# EAGLE design cicely_A_v1 (EAGLE 9.6.2)
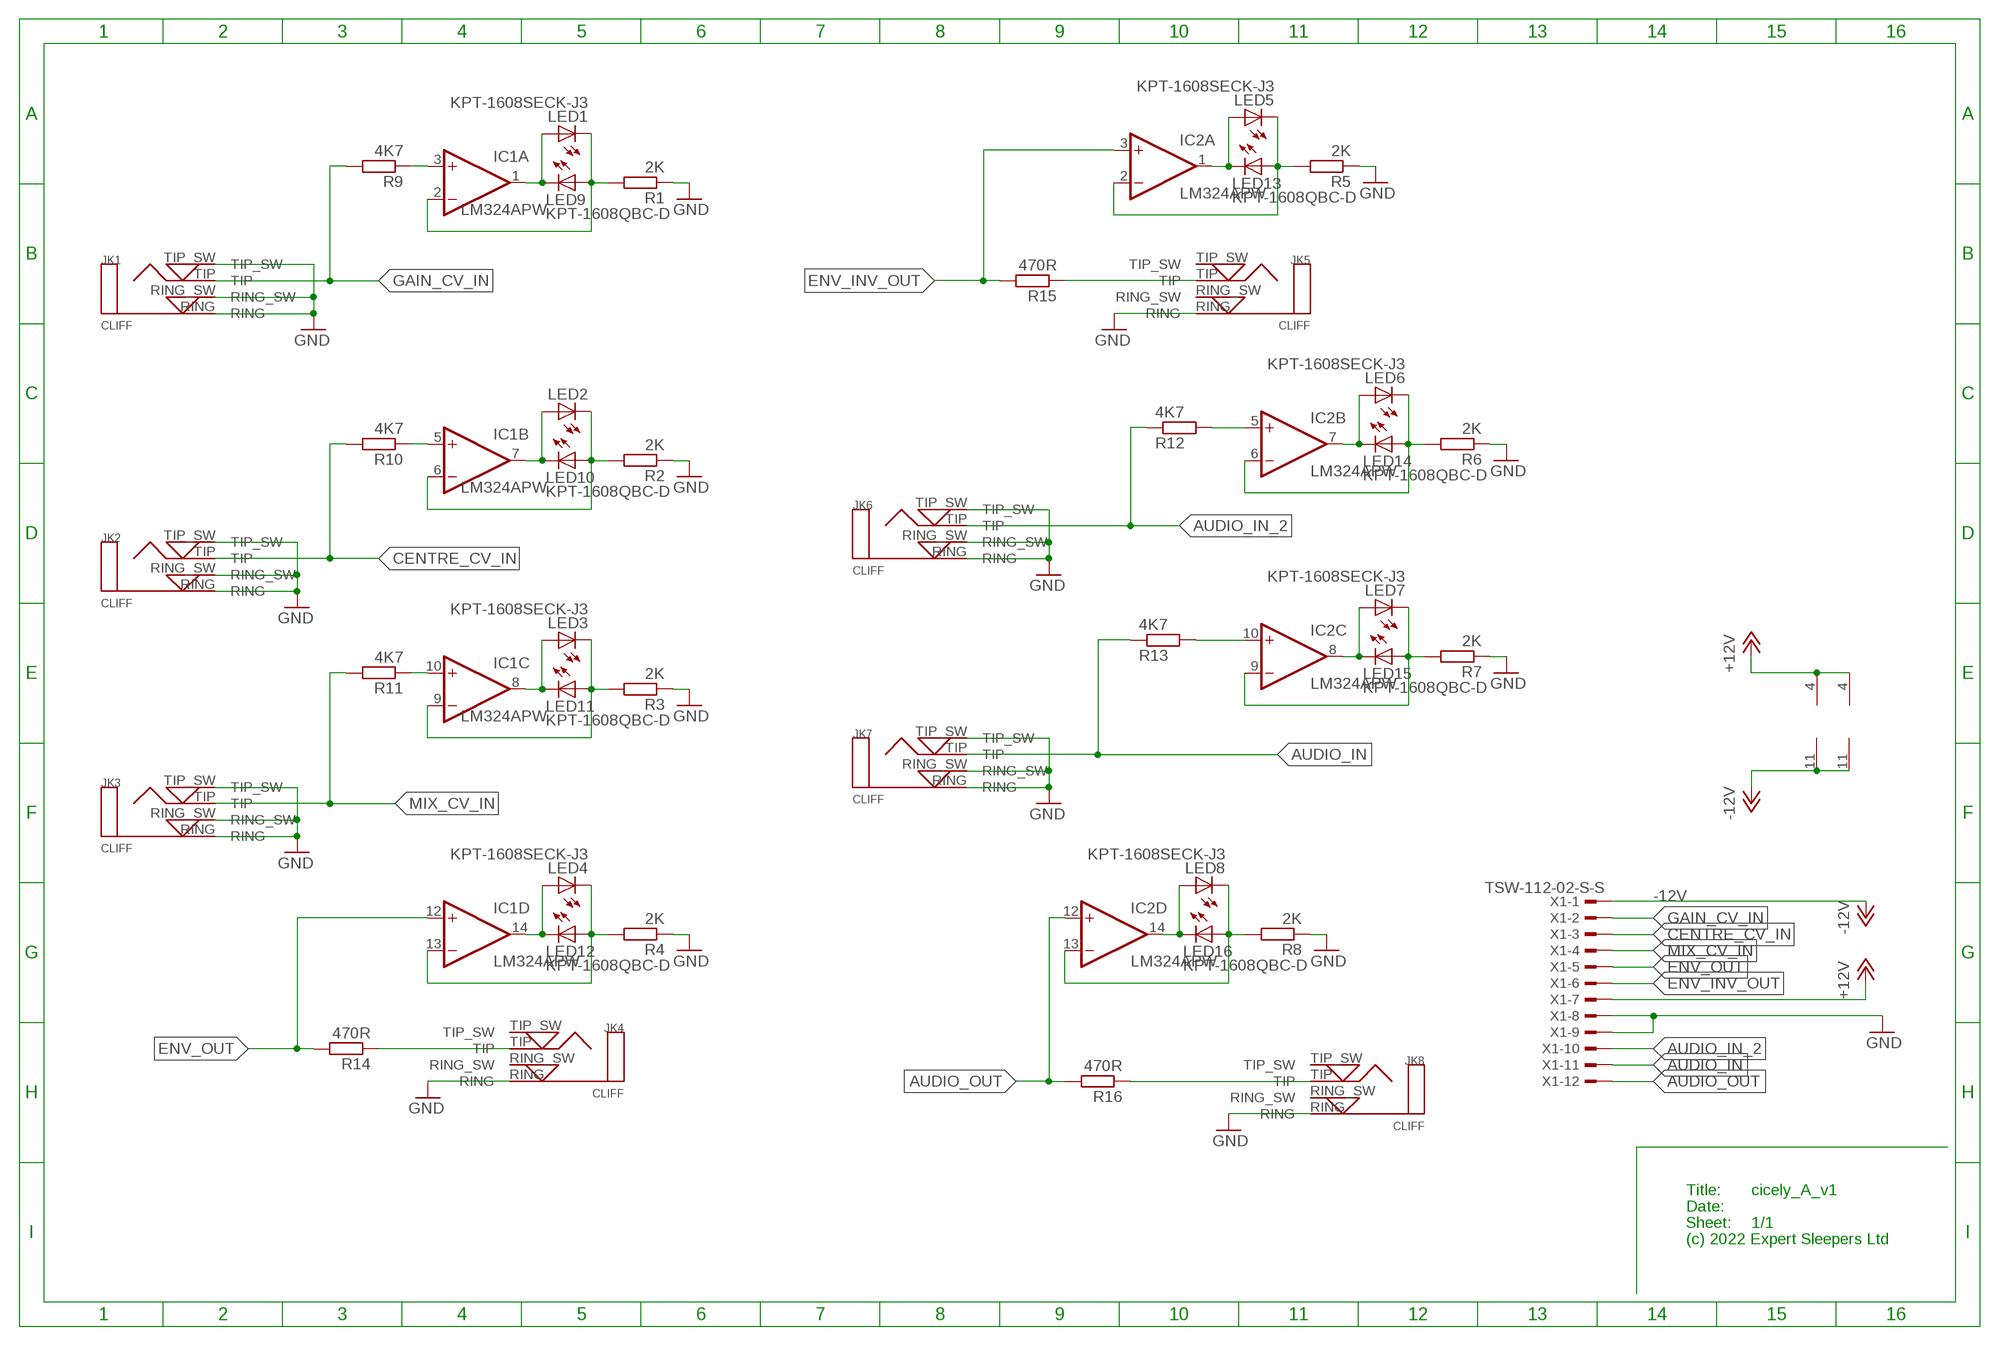
[diagram p0: schematic, sheet 1]

## Parts
IC1  LM324APW  TL074PW  [PW_R-PDSO-G14]
IC2  LM324APW  TL074PW  [PW_R-PDSO-G14]
JK1  CLIFF  CLIFF3.5MM_PCB_SW_JK  [CLIFF3.5MMPCB]
JK2  CLIFF  CLIFF3.5MM_PCB_SW_JK  [CLIFF3.5MMPCB]
JK3  CLIFF  CLIFF3.5MM_PCB_SW_JK  [CLIFF3.5MMPCB]
JK4  CLIFF  CLIFF3.5MM_PCB_SW_JK  [CLIFF3.5MMPCB]
JK5  CLIFF  CLIFF3.5MM_PCB_SW_JK  [CLIFF3.5MMPCB]
JK6  CLIFF  CLIFF3.5MM_PCB_SW_JK  [CLIFF3.5MMPCB]
JK7  CLIFF  CLIFF3.5MM_PCB_SW_JK  [CLIFF3.5MMPCB]
JK8  CLIFF  CLIFF3.5MM_PCB_SW_JK  [CLIFF3.5MMPCB]
LED1  KPT-1608SECK-J3  [CHIPLED_0603_LEFT]
LED2  KPT-1608SECK-J3  [CHIPLED_0603_LEFT]
LED3  KPT-1608SECK-J3  [CHIPLED_0603_LEFT]
LED4  KPT-1608SECK-J3  [CHIPLED_0603_LEFT]
LED5  KPT-1608SECK-J3  [CHIPLED_0603_LEFT]
LED6  KPT-1608SECK-J3  [CHIPLED_0603_LEFT]
LED7  KPT-1608SECK-J3  [CHIPLED_0603_LEFT]
LED8  KPT-1608SECK-J3  [CHIPLED_0603_LEFT]
LED9  KPT-1608QBC-D  [CHIPLED_0603_RIGHT]
LED10  KPT-1608QBC-D  [CHIPLED_0603_RIGHT]
LED11  KPT-1608QBC-D  [CHIPLED_0603_RIGHT]
LED12  KPT-1608QBC-D  [CHIPLED_0603_RIGHT]
LED13  KPT-1608QBC-D  [CHIPLED_0603_RIGHT]
LED14  KPT-1608QBC-D  [CHIPLED_0603_RIGHT]
LED15  KPT-1608QBC-D  [CHIPLED_0603_RIGHT]
LED16  KPT-1608QBC-D  [CHIPLED_0603_RIGHT]
R1  2K  R-EU_R1206  [R1206]
R2  2K  R-EU_R1206  [R1206]
R3  2K  R-EU_R1206  [R1206]
R4  2K  R-EU_R1206  [R1206]
R5  2K  R-EU_R1206  [R1206]
R6  2K  R-EU_R1206  [R1206]
R7  2K  R-EU_R1206  [R1206]
R8  2K  R-EU_R1206  [R1206]
R9  4K7  R-EU_R1206  [R1206]
R10  4K7  R-EU_R1206  [R1206]
R11  4K7  R-EU_R1206  [R1206]
R12  4K7  R-EU_R1206  [R1206]
R13  4K7  R-EU_R1206  [R1206]
R14  470R  R-EU_R1206  [R1206]
R15  470R  R-EU_R1206  [R1206]
R16  470R  R-EU_R1206  [R1206]
X1  TSW-112-02-S-S  [TSW-112-02-S-S]

## Nets
+12V: IC1.4(P:V+) IC2.4(P:V+) X1.7
-12V: IC1.11(P:V-) IC2.11(P:V-) X1.1
AUDIO_IN: JK7.TIP R13.1 X1.11
AUDIO_IN_2: JK6.TIP R12.1 X1.10
AUDIO_OUT: IC2.12(D:+IN) R16.2 X1.12
CENTRE_CV_IN: JK2.TIP R10.2 X1.3
ENV_INV_OUT: IC2.3(A:+IN) R15.2 X1.6
ENV_OUT: IC1.12(D:+IN) R14.2 X1.5
ENV_OUT_JACK: JK4.TIP R14.1
ENV_OUT_JACK1: JK5.TIP R15.1
GAIN_CV_IN: JK1.TIP R9.2 X1.2
GND [power]: JK1.RING JK1.RING_SW JK1.TIP_SW JK2.RING JK2.RING_SW JK2.TIP_SW JK3.RING JK3.RING_SW JK3.TIP_SW JK4.RING JK5.RING JK6.RING JK6.RING_SW JK6.TIP_SW JK7.RING JK7.RING_SW JK7.TIP_SW JK8.RING R1.1 R2.1 R3.1 R4.1 R5.1 R6.1 R7.1 R8.1 X1.8 X1.9
MIX_CV_IN: JK3.TIP R11.2 X1.4
N$3: IC1.10(C:+IN) R11.1
N$4: IC1.13(D:-IN) LED4.1(C) LED12.1(A) R4.2
N$5: IC1.14(D:OUT) LED4.2(A) LED12.2(C)
N$6: IC2.2(A:-IN) LED5.1(C) LED13.1(A) R5.2
N$11: IC1.8(C:OUT) LED3.2(A) LED11.2(C)
N$16: IC1.5(B:+IN) R10.1
N$17: IC1.9(C:-IN) LED3.1(C) LED11.1(A) R3.2
N$19: IC1.1(A:OUT) LED1.2(A) LED9.2(C)
N$21: IC2.10(C:+IN) R13.2
N$22: IC1.2(A:-IN) LED1.1(C) LED9.1(A) R1.2
N$25: IC1.3(A:+IN) R9.1
N$29: IC1.7(B:OUT) LED2.2(A) LED10.2(C)
N$30: IC1.6(B:-IN) LED2.1(C) LED10.1(A) R2.2
N$47: IC2.5(B:+IN) R12.2
N$62: IC2.8(C:OUT) LED7.2(A) LED15.2(C)
N$63: IC2.9(C:-IN) LED7.1(C) LED15.1(A) R7.2
N$65: IC2.14(D:OUT) LED8.2(A) LED16.2(C)
N$66: IC2.13(D:-IN) LED8.1(C) LED16.1(A) R8.2
N$71: IC2.7(B:OUT) LED6.2(A) LED14.2(C)
N$72: IC2.6(B:-IN) LED6.1(C) LED14.1(A) R6.2
N$76: JK8.TIP R16.1
N$89: IC2.1(A:OUT) LED5.2(A) LED13.2(C)
Unconnected: JK4.RING_SW JK4.TIP_SW JK5.RING_SW JK5.TIP_SW JK8.RING_SW JK8.TIP_SW

## Notes on the sheet
- Title:
- Date:
- Sheet:
- (c) 2022 Expert Sleepers Ltd

## Library data of the parts
IC1 IC2 = digital-audio:TL074: OP AMP
JK1-JK8 = cliff:CLIFF3.5MM_PCB_SW_JK: Cliff 3.5mm Mono PCB switched jack socket
LED1-LED8 = kingbright:KPT-1608SECK-J3
LED9-LED16 = kingbright:KPT-1608QBC-D
R1-R16 = rcl:R-EU_: RESISTOR, European symbol
X1 = con-samtec:TSW-112-02-S-S: THROUGH-HOLE .025" SQ POST HEADER Source: Samtec TSW.pdf; OC_FARNELL: unknown; OC_NEWARK: unknown

## Board
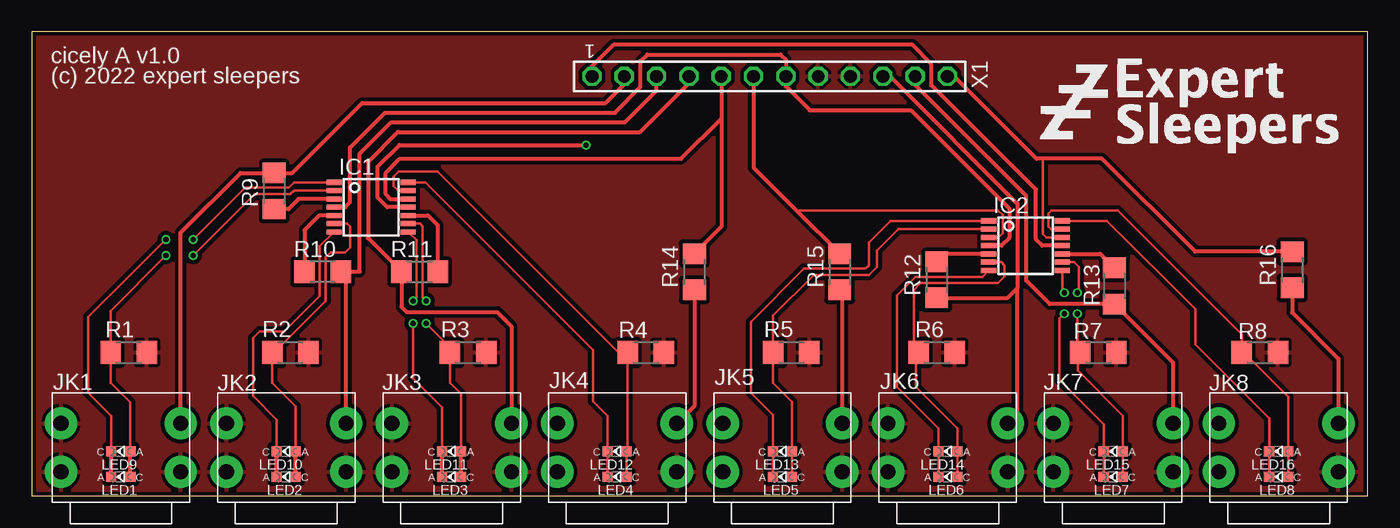
[diagram p1: board, top side]
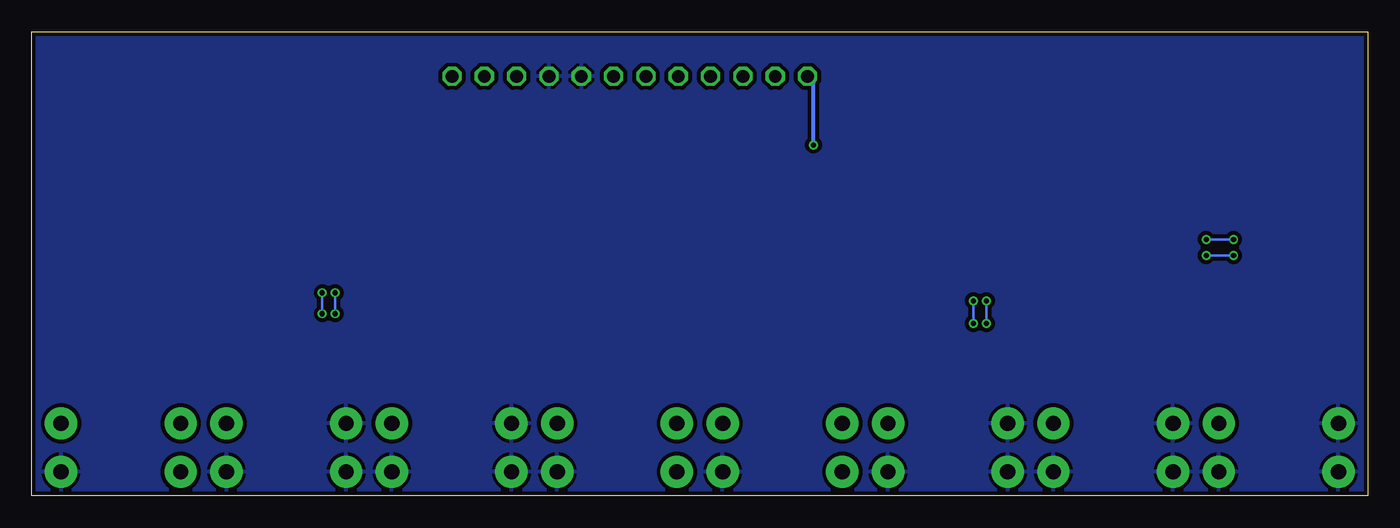
[diagram p2: board, bottom side, seen from below]

Size 105 x 36.5 mm. Coordinates in mm from the lower left corner, seen from the top.
Outline: 0,0 105,0 105,36.5 0,36.5 0,0
Copper layers (1*16): Top 0.035mm / dielectric 1.5mm / Bottom 0.035mm
Design rules "pcbtrain *": minimum track width 0.125mm, minimum drill 0.3mm, track to track 0.125mm, track to pad 0.125mm, pad to pad 0.125mm, via to via 0.125mm, smd to smd 0.125mm, copper to edge 0.25mm, drill to drill 8mil, minimum pad ring 0.15mm, minimum via ring 0.15mm, stop-mask expansion 4mil, vias tented up to drill 0mil, thermal gap 10mil

### Footprints (pad centres in the part's own frame; a part is rotated, then mirrored left to right if it is on the bottom)
PW_R-PDSO-G14 = smd 0.4 x 1.2: 1 -1.95,-2.9; 2 -1.3,-2.9; 3 -0.65,-2.9; 4 0,-2.9; 5 0.65,-2.9; 6 1.3,-2.9; 7 1.95,-2.9; 8 1.95,2.9; 9 1.3,2.9; 10 0.65,2.9; 11 0,2.9; 12 -0.65,2.9; 13 -1.3,2.9; 14 -1.95,2.9
CLIFF3.5MMPCB = drill 1.2 pad 2.54: RING 4.7,-1.9; RING_SW -4.7,-1.9; TIP 4.7,1.9; TIP_SW -4.7,1.9
CHIPLED_0603_LEFT = smd 0.8 x 0.8: 1 0,-0.75; 2 0,0.75
CHIPLED_0603_RIGHT = smd 0.8 x 0.8: 1 0,-0.75; 2 0,0.75
R1206 = smd 1.6 x 1.803: 1 -1.422,0; 2 1.422,0
TSW-112-02-S-S = drill 1 pad 1.5 octagon: 1 13.97,0; 2 11.43,0; 3 8.89,0; 4 6.35,0; 5 3.81,0; 6 1.27,0; 7 -1.27,0; 8 -3.81,0; 9 -6.35,0; 10 -8.89,0; 11 -11.43,0; 12 -13.97,0

### Placement (x,y rotation side)
IC1  26.67,22.71 270 top
IC2  78.11,19.68 270 top
JK1  7,3.8 0 top
JK2  20,3.8 0 top
JK3  33,3.8 0 top
JK4  46,3.8 0 top
JK5  59,3.8 0 top
JK6  72,3.8 0 top
JK7  85,3.8 0 top
JK8  98,3.8 0 top
LED1  7,1.5 90 top
LED2  20,1.5 90 top
LED3  33,1.5 90 top
LED4  46,1.5 90 top
LED5  59,1.5 90 top
LED6  72,1.5 90 top
LED7  85,1.5 90 top
LED8  98,1.5 90 top
LED9  7,3.5 90 top
LED10  20,3.5 90 top
LED11  33,3.5 90 top
LED12  46,3.5 90 top
LED13  59,3.5 90 top
LED14  72,3.5 90 top
LED15  85,3.5 90 top
LED16  98,3.5 90 top
R1  7.62,11.28 180 top
R2  20.32,11.28 180 top
R3  34.29,11.28 180 top
R4  48.26,11.28 180 top
R5  59.69,11.28 180 top
R6  71.12,11.28 180 top
R7  83.82,11.28 180 top
R8  96.52,11.28 180 top
R9  19.05,23.98 90 top
R10  22.86,17.63 0 top
R11  30.48,17.63 180 top
R12  71.12,17 90 top
R13  85.09,16.51 90 top
R14  52.07,17.63 90 top
R15  63.5,17.63 90 top
R16  99.06,17.78 90 top
U$1  [ES_ZZZ_TEXT_TPLACE_1IN_600DPI]  78.28,26.53 0 top
X1  58,33 180 top

### Tracks (layer width: path | path; a pad name or v marks a point on that pad's centre or on a via)
+12V
  Top 0.305: IC1.4 24.64,22.71 25.02,23.09 25.02,27.41 27.75,30.14 45.85,30.14 47.84,32.17 47.84,34.2 48.39,34.71 58.86,34.71 59.27,34.31 X1.7 59.27,32.21 61.15,30.33 69.09,30.33 76.83,22.58 76.83,20.3 76.22,19.68 IC2.4
-12V  (via drill 0.4)
  Top 0.305: IC2.11 79.42,19.68 78.93,20.17 78.93,24.11 70.7,32.3 70.7,33.95 69.21,35.47 45.72,35.47 44.03,33.78 X1.1 | IC1.11 27.94,22.71 27.18,23.47 27.18,25.89 28.89,27.6 v43.56,27.6
  Bottom 0.305: v43.56,27.6 43.56,32.53 X1.1
AUDIO_IN
  Top 0.305: X1.11 69.43,32.34 78.17,23.6 78.17,16.93 80.01,15.09 R13.1 87.63,12.55 89.7,10.48 JK7.TIP
AUDIO_IN_2
  Top 0.305: X1.10 67.43,33 77.47,22.96 77.47,16.36 | JK6.TIP 77.47,6.47 77.47,16.36 | R12.1 76.68,15.57 77.47,16.36
AUDIO_OUT
  Top 0.203: IC2.12 79.73,20.34 79.48,20.59 79.48,26.52
  Top 0.305: R16.2 91.44,19.2 84.12,26.52 79.48,26.52 78.97,26.52 72.49,33 X1.12
CENTRE_CV_IN
  Top 0.305: X1.3 49.11,31.88 46.61,29.38 28.26,29.38 25.78,26.9 25.78,17.63 R10.2 24.7,17.21 JK2.TIP
ENV_INV_OUT
  Top 0.203: IC2.3 75.98,20.34 76.33,20.68 76.33,22.07 75.95,22.46 60.1,22.46
  Top 0.305: X1.6 56.73,25.82 60.1,22.46 R15.2
ENV_OUT
  Top 0.305: 54.19,29.68 51.03,26.52 28.93,26.52 27.82,25.41 27.82,23.72 28.18,23.36 IC1.12 | X1.5 54.19,29.68 | R14.2 54.19,21.17 54.19,29.68
ENV_OUT_JACK
  Top 0.305: R14.1 52.07,7.07 JK4.TIP
ENV_OUT_JACK1
  Top 0.305: JK5.TIP 63.7,16.01 R15.1
GAIN_CV_IN
  Top 0.305: JK1.TIP 11.7,20.69 16.41,25.4 R9.2 20.47,25.4 25.97,30.9 45.08,30.9 46.57,32.39 X1.2
GND
  pour Top (isolate 0.305): 0,0 105,0 105,36.5 0,36.5
  pour Bottom (isolate 0.305): 0,0 105,0 105,36.5 0,36.5
MIX_CV_IN
  Top 0.305: X1.4 51.65,32.45 47.82,28.62 28.77,28.62 26.42,26.27 26.42,20.27 R11.2 29.06,14.86 29.46,14.46 36.58,14.46 37.7,13.33 JK3.TIP
N$3
  Top 0.305: IC1.10 31.13,22.06 31.9,21.29 R11.1
N$4
  Top 0.203: LED4.1 LED12.1 46.84,3.59 R4.2 46.1,11.28 31.88,25.5 28.83,25.5 28.45,25.12 28.45,24.36 28.8,24.01 IC1.13
N$5
  Top 0.203: LED4.2 LED12.2 45.25,6.29 44.11,7.44 44.11,11.5 30.94,24.66 IC1.14
N$6
  Top 0.203: LED5.1 LED13.1 59.75,7.41 58.27,8.89 R5.2 58.27,14.18 61.47,17.38 65.79,17.38 66.42,18.01 66.42,19.28 68.12,20.98 IC2.2
N$11  (via drill 0.4)
  Top 0.203: IC1.8 30.23,20.1 30.23,15.6 v29.97,15.34 | v29.97,13.57 29.97,9.25 32.25,6.97 LED11.2
  Top 0.305: LED3.2 LED11.2
  Bottom 0.203: v29.97,15.34 v29.97,13.57
N$16
  Top 0.305: IC1.5 22.59,22.06 21.44,20.91 R10.1
N$17  (via drill 0.4)
  Top 0.203: IC1.9 30.51,21.41 30.73,21.19 30.73,15.6 v30.99,15.34 | v30.99,13.57 32.87,11.69 R3.2 32.87,8.89 33.75,8.01 LED11.1
  Top 0.305: LED3.1 LED11.1
  Bottom 0.203: v30.99,15.34 v30.99,13.57
N$19  (via drill 0.4)
  Top 0.203: IC1.1 20.62,24.66 20.19,24.23 16.76,24.23 v12.7,20.17 | v10.54,20.17 4.45,14.07 4.45,8.11 6.25,6.3 LED9.2
  Top 0.305: LED1.2 LED9.2
  Bottom 0.203: v12.7,20.17 v10.54,20.17
N$21
  Top 0.305: IC2.10 83.99,19.04 R13.2
N$22  (via drill 0.4)
  Top 0.203: IC1.2 20.6,24.01 20.32,23.73 17.53,23.73 v12.7,18.9 | v10.54,18.9 6.2,14.56 R1.2 6.2,8.89 7.75,7.34 LED9.1
  Top 0.305: LED1.1 LED9.1
  Bottom 0.203: v12.7,18.9 v10.54,18.9
N$25
  Top 0.305: IC1.3 20.97,23.36 20.17,22.56 R9.1
N$29
  Top 0.203: IC1.7 22.64,19.63 22.64,15.72 19.85,12.93 17.91,12.93 17.4,12.42 17.4,7.85 19.25,6 LED10.2
  Top 0.305: LED2.2 LED10.2
N$30
  Top 0.203: IC1.6 24.8,21.41 25.02,21.19 25.02,19.54 24.64,19.15 23.5,19.15 23.11,18.77 23.11,15.34 19.05,11.28 R2.2 18.9,8.89 20.75,7.04 LED10.1
  Top 0.305: LED2.1 LED10.1
N$47
  Top 0.305: IC2.5 71.74,19.04 R12.2
N$62  (via drill 0.4)
  Top 0.203: LED7.2 LED15.2 84.25,5.64 80.77,9.12 80.77,13.95 v81.15,14.33 | IC2.8 81,16.13 v81.15,15.98
  Bottom 0.203: v81.15,15.98 v81.15,14.33
N$63  (via drill 0.4)
  Top 0.203: LED7.1 LED15.1 85.75,6.31 82.21,9.85 82.21,11.47 82.17,11.51 v82.17,14.33 | IC2.9 81.92,18.39 82.3,18.01 82.3,16.11 v82.17,15.98
  Top 0.305: 82.21,11.47 R7.2
  Bottom 0.203: v82.17,15.98 v82.17,14.33
N$65
  Top 0.203: LED8.2 LED16.2 97.25,6.11 91.44,11.91 91.44,14.71 84.51,21.64 IC2.14
N$66
  Top 0.203: LED8.1 LED16.1 98.75,7.78 95.25,11.28 R8.2 95.1,12.7 85.34,22.46 80.14,22.46 79.88,22.2 79.88,21.19 80.08,20.98 IC2.13
N$71
  Top 0.203: LED6.2 LED14.2 71.25,5.31 67.98,8.58 67.98,15.76 69.45,17.23 74.7,17.23 IC2.7
N$72
  Top 0.203: LED6.1 LED14.1 72.75,5.31 69.48,8.58 69.48,11.5 R6.2 69.32,11.66 69.32,16.21 69.85,16.74 75.95,16.74 76.45,17.25 76.45,18.14 76.21,18.39 IC2.6
N$76
  Top 0.305: JK8.TIP 102.7,10.78 99.06,14.42 R16.1
N$89
  Top 0.203: LED5.2 LED13.2 58.25,6.37 56.52,8.11 56.52,13.69 60.71,17.88 65.53,17.88 65.79,18.14 65.79,19.92 67.5,21.64 IC2.1

### Text on the board
tPlace: cicely A v1.0 | (c) 2022 expert sleepers